# Altium schematic sheet smf_control_block.SchDoc
size A4
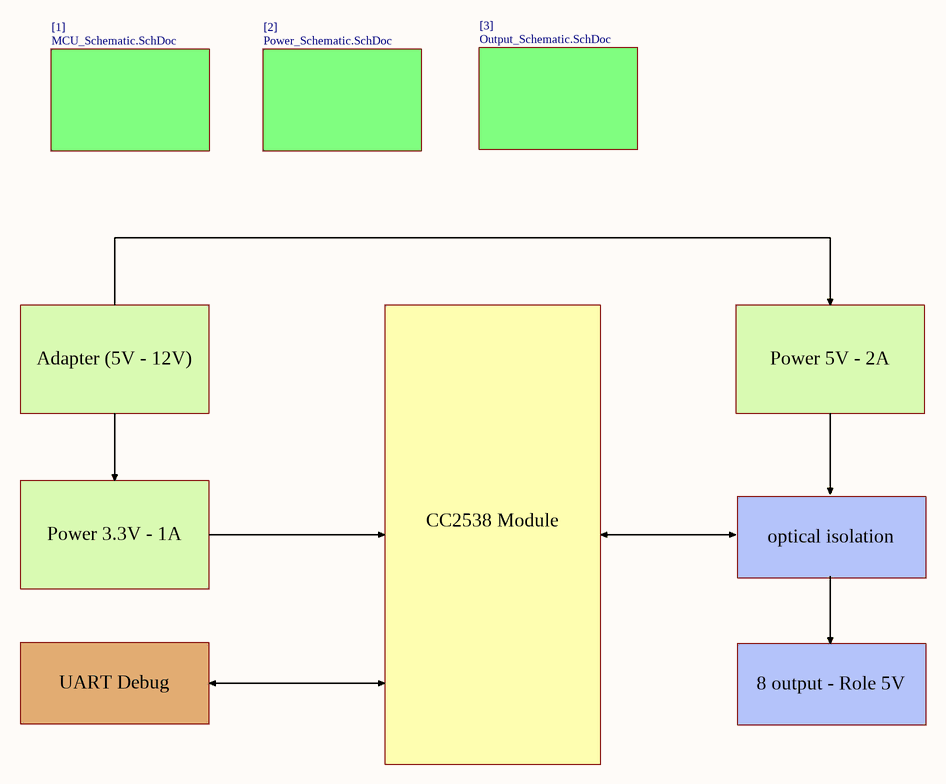
[diagram p0: smf_control_block.SchDoc]

## Sub-sheets
[1] = MCU_Schematic.SchDoc: no entries
[2] = Power_Schematic.SchDoc: no entries
[3] = Output_Schematic.SchDoc: no entries

## Notes on the sheet
- Power 5V - 2A
- Adapter (5V - 12V) - 3A
- Power 3.3V - 1A
- CC2538 Module
- optical isolation
- UART Debug
- 8 output - Role 5V